# Altium schematic sheet FRAM.SchDoc
size A
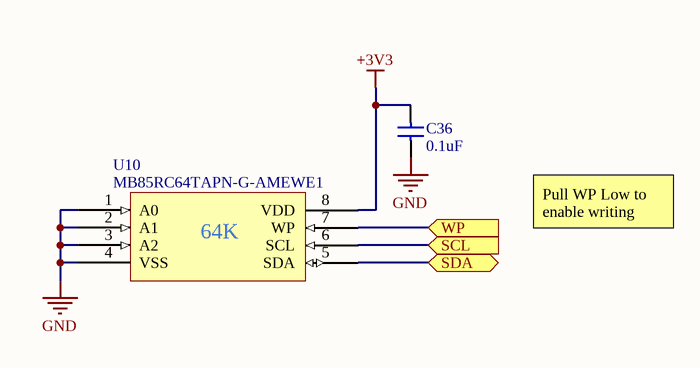
[diagram p0: FRAM.SchDoc]

## Parts
C36  value 0.1uF  [0603_CAPACITOR]  (hidden comment: CAP 0.1uF 50V X7R)
U10  MB85RC64TAPN-G-AMEWE1  [WFDFN-8-EP-Long]

## Ports
SCL (in), SDA (bidir), WP (in)

## Nets
+3V3: C36.1 U10.8(VDD)
GND: C36.2 U10.1(A0) U10.2(A1) U10.3(A2) U10.4(VSS)
SCL: U10.6(SCL) ; port SCL
SDA: U10.5(SDA) ; port SDA
WP: U10.7(WP) ; port WP

## Notes on the sheet
- Pull WP Low to enable writing
- (in symbol U_MB85RC64TA) 64K

## Library data of the parts
C36 = C_0603_0.1uF_50V_10%: CAP CERM 0.1uF 10% 50V 0603; SVP Creator: Spencer Berglund; Package: =SelectedPackage; Voltage: 50V; Temperature Coefficient: X7R; Supplier 1: Digi-Key; Supplier Part Number 1: 1276-1000-1-ND
U10 = U_MB85RC64TA: FRAM (Ferroelectric RAM) Memory IC 64Kb (8K x 8) I²C 3.4MHz 8-SON; Manufacturer: Fujitsu; Supplier 1: Digi-Key; Supplier Part Number 1: 865-1275-6-ND; Manufacturer Part Number: MB85RC64TAPN-G-AMEWE1